# Altium schematic sheet Motion_Driver_v2.SchDoc: Motion Driver
size A4; Author: Nikola Rašević; Organization: Memristor-Robotics; Address1: Vladimira Perića Valtera 2; Address2: 21000 Novi Sad; Address3: Serbia; Revision: v2; SheetNumber: 1; SheetTotal: 11
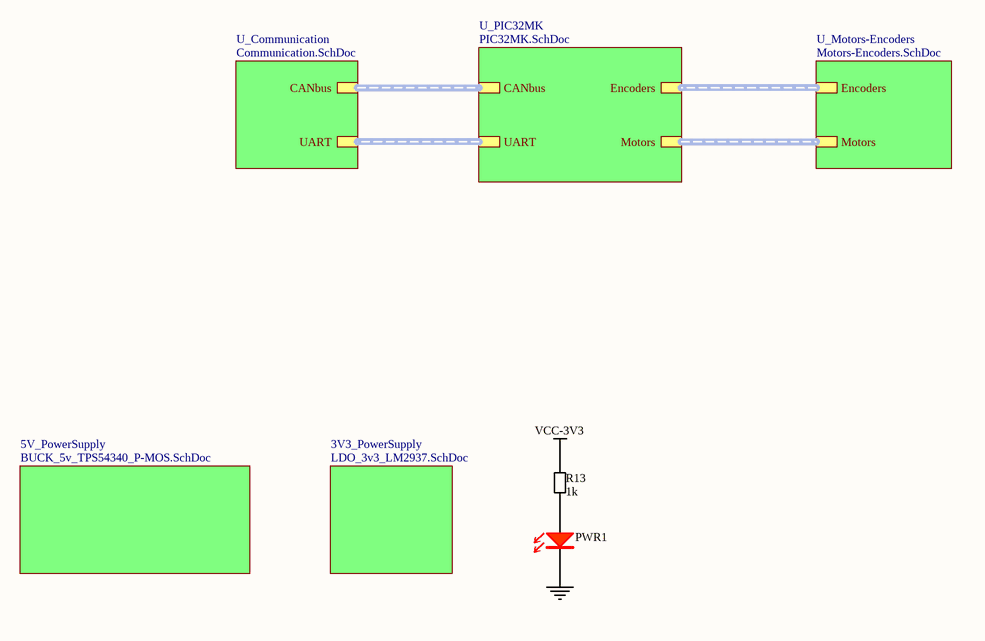
[diagram p0: Motion_Driver_v2.SchDoc]

## Parts
PWR1  LED RED  [LED_RED_0805]  (value not drawn)
R13  1k  [RESC2013X38N-0805-NOOVERLAY]

## Sub-sheets
3V3_PowerSupply = LDO_3v3_LM2937.SchDoc: no entries
5V_PowerSupply = BUCK_5v_TPS54340_P-MOS.SchDoc: no entries
U_Communication = Communication.SchDoc: CANbus (harness CANbus), UART (harness UART)
U_Motors-Encoders = Motors-Encoders.SchDoc: Encoders (harness Encoders), Motors (harness Motors)
U_PIC32MK = PIC32MK.SchDoc: CANbus (harness CANbus), UART (harness UART), Encoders (harness Encoders), Motors (harness Motors)

## Nets
GND: PWR1.1(C)
VCC-3V3: R13.2
NetPWR1_2: PWR1.2(A) R13.1

## Buses and harness runs
harness sheet U_Communication/CANbus = sheet U_PIC32MK/CANbus
harness sheet U_Communication/UART = sheet U_PIC32MK/UART
harness sheet U_Motors-Encoders/Encoders = sheet U_PIC32MK/Encoders
harness sheet U_Motors-Encoders/Motors = sheet U_PIC32MK/Motors

## Notes on the sheet
- Title
- Date:
- Design Engineer:
- Time:
- Revision:
- Sheet
- of
- Size:
- A4
- www.memristor-robotics.io
- File:

## Library data of the parts
PWR1 = LED_RED_0805: LED RED 0805; Manufacturer: BRIGHT LED ELECTRONICS; Manufacturer Part Number: BL-HUB35A-AV-TRB; Barcode: 2911010024321; id: 35; Assembly: SMD; Voltage Forward: 2.0 V; item_id: 3341; Recommended Rating: Platinum; Package Case: 0805 (2012 Metric); Color: Red; Family: LED; Part Type: Optoelectronics
R13 = 00001001: RES SMD 1 kOhm 1/8W 0805; Power: 0.125W, 1/8W; Barcode: 00009101; Resistance: 1k; Assembly: SMD